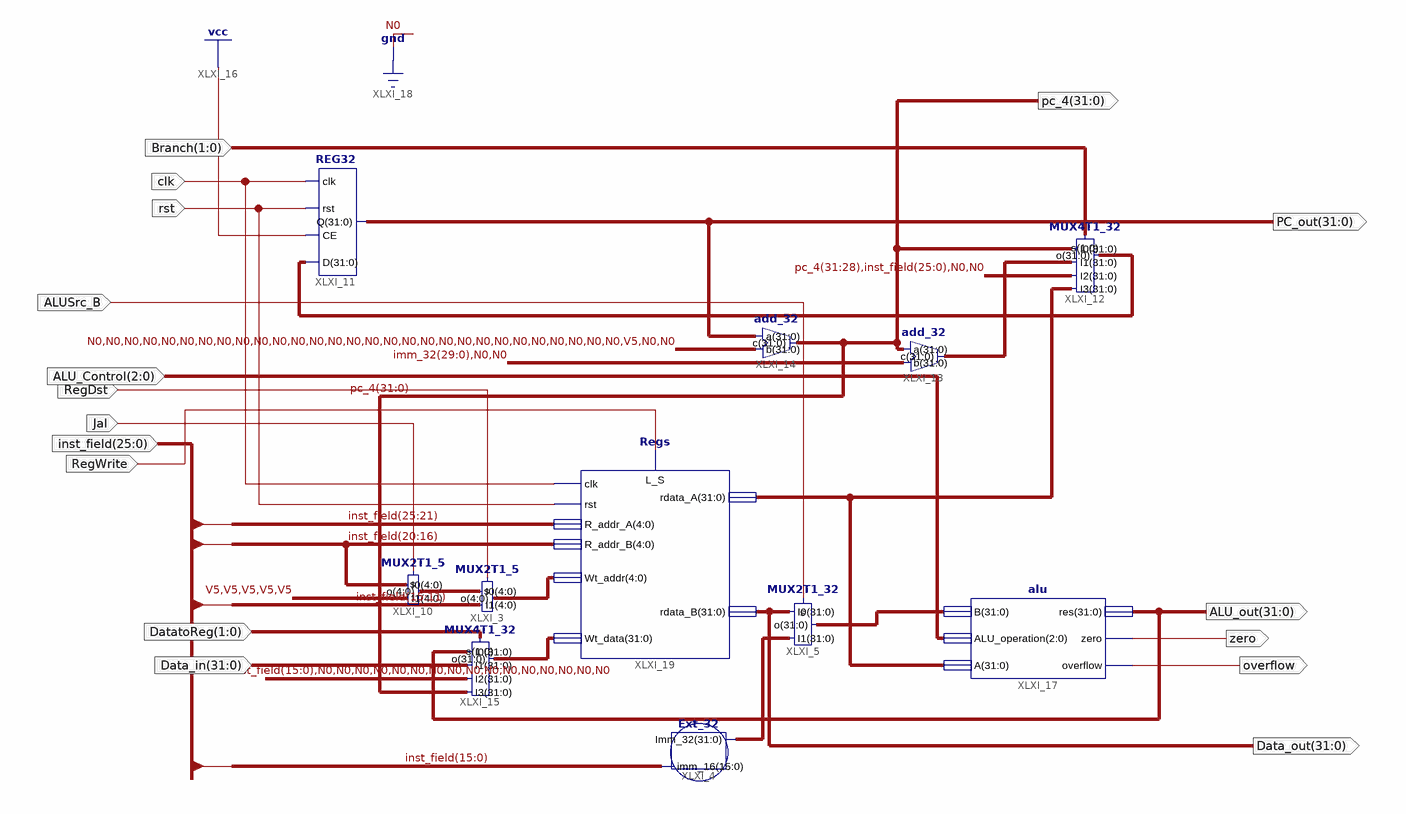
[diagram p0: schematic sheet 1]
// Xilinx ISE schematic Data_path_more.sch (kintex7) as structural Verilog: 11 symbols, 17 ports
module Data_path_more (
  input  clk,
  input  rst,
  input  [25:0] inst_field,
  input  Jal,
  input  RegDst,
  input  [31:0] Data_in,
  input  [1:0] DatatoReg,
  input  [2:0] ALU_Control,
  input  [1:0] Branch,
  input  ALUSrc_B,
  input  RegWrite,
  output [31:0] PC_out,
  output [31:0] Data_out,
  output zero,
  output overflow,
  output [31:0] ALU_out,
  output [31:0] pc_4
);

  wire [4:0] XLXN_25, XLXN_27;
  wire [31:0] a, b, imm_32, sb, XLXN_28, XLXN_50;

  MUX2T1_5 XLXI_3 (.I1(inst_field[15:11]), .I0(XLXN_25), .o(XLXN_27), .s(RegDst));
  Ext_32 XLXI_4 (.imm_16(inst_field[15:0]), .Imm_32(imm_32));
  MUX2T1_32 XLXI_5 (.s(ALUSrc_B), .I0(Data_out), .I1(imm_32), .o(b));
  MUX2T1_5 XLXI_10 (.I1({5{1'b1}}), .I0(inst_field[20:16]), .o(XLXN_25), .s(Jal));
  REG32 XLXI_11 (.D(sb), .CE(1'b1), .rst(rst), .clk(clk), .Q(PC_out));
  MUX4T1_32 XLXI_12 (.s(Branch), .I0(pc_4), .I1(XLXN_50), .I2({pc_4[31:28], inst_field, 2'b00}), .I3(a), .o(sb));
  add_32 XLXI_13 (.c(XLXN_50), .a(pc_4), .b({imm_32[29:0], 2'b00}));
  add_32 XLXI_14 (.c(pc_4), .a(PC_out), .b(32'b00000000000000000000000000000100));
  MUX4T1_32 XLXI_15 (
    .s(DatatoReg), .I0(ALU_out), .I1(Data_in), .I2({inst_field[15:0], {16{1'b0}}}), .I3(pc_4), .o(XLXN_28));
  alu XLXI_17 (.B(b), .ALU_operation(ALU_Control), .A(a), .res(ALU_out), .zero(zero), .overflow(overflow));
  Regs XLXI_19 (
    .clk(clk), .L_S(RegWrite), .rdata_A(a), .rst(rst), .Wt_data(XLXN_28), .rdata_B(Data_out),
    .R_addr_A(inst_field[25:21]), .R_addr_B(inst_field[20:16]), .Wt_addr(XLXN_27));
endmodule
